# EAGLE design TConnector (EAGLE 6.5.0)
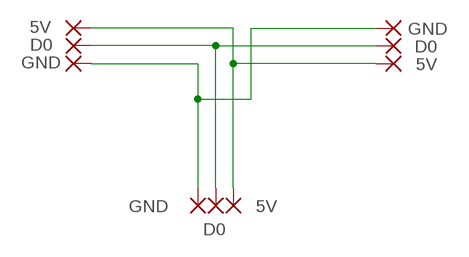
[diagram p0: schematic, sheet 1]

## Parts
5V@1  5V  SMD2  [SMD1,27-2,54]
5V@2  5V  SMD2  [SMD1,27-2,54]
5V@3  5V  SMD2  [SMD1,27-2,54]
D0  D0  SMD2  [SMD1,27-2,54]
GND@1  GND  SMD2  [SMD1,27-2,54]
GND@2  GND  SMD2  [SMD1,27-2,54]
GND@3  GND  SMD2  [SMD1,27-2,54]
PAD5  D0  SMD2  [SMD1,27-2,54]
PAD8  D0  SMD2  [SMD1,27-2,54]

## Nets
5V: 5V@1.1(P) 5V@2.1(P) 5V@3.1(P)
D0: D0.1(P) PAD5.1(P) PAD8.1(P)
GND: GND@1.1(P) GND@2.1(P) GND@3.1(P)

## Library data of the parts
5V@1-5V@3 D0 GND@1-GND@3 PAD5 PAD8 = wirepad:SMD2: SMD PAD

## Board
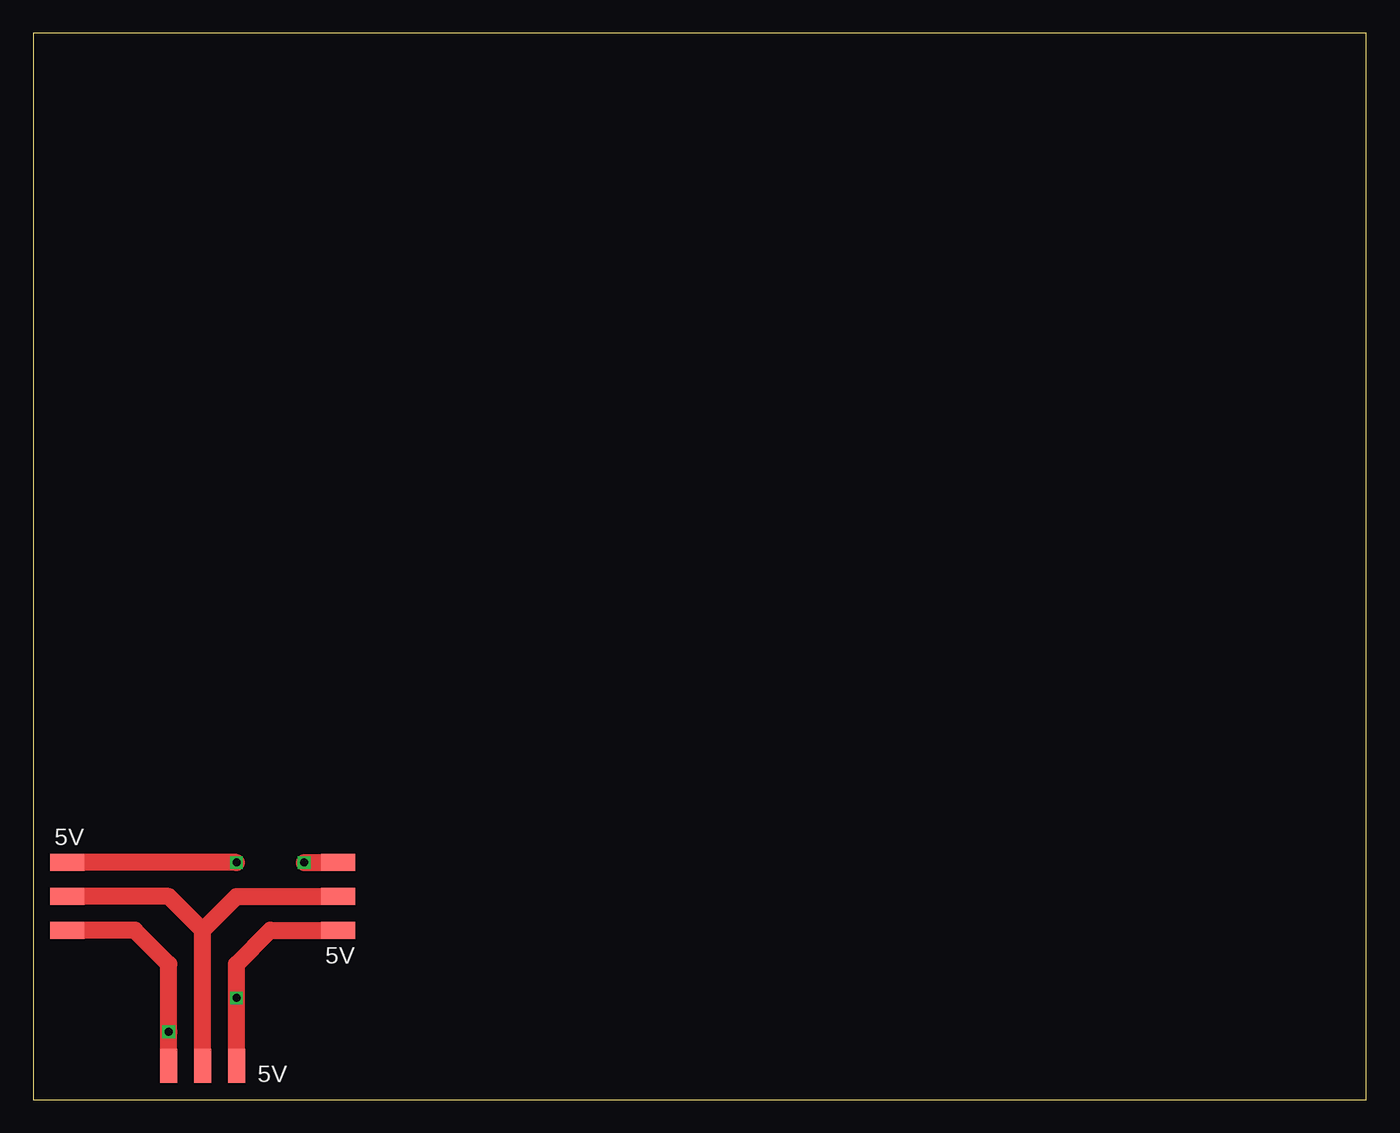
[diagram p1: board, top side]
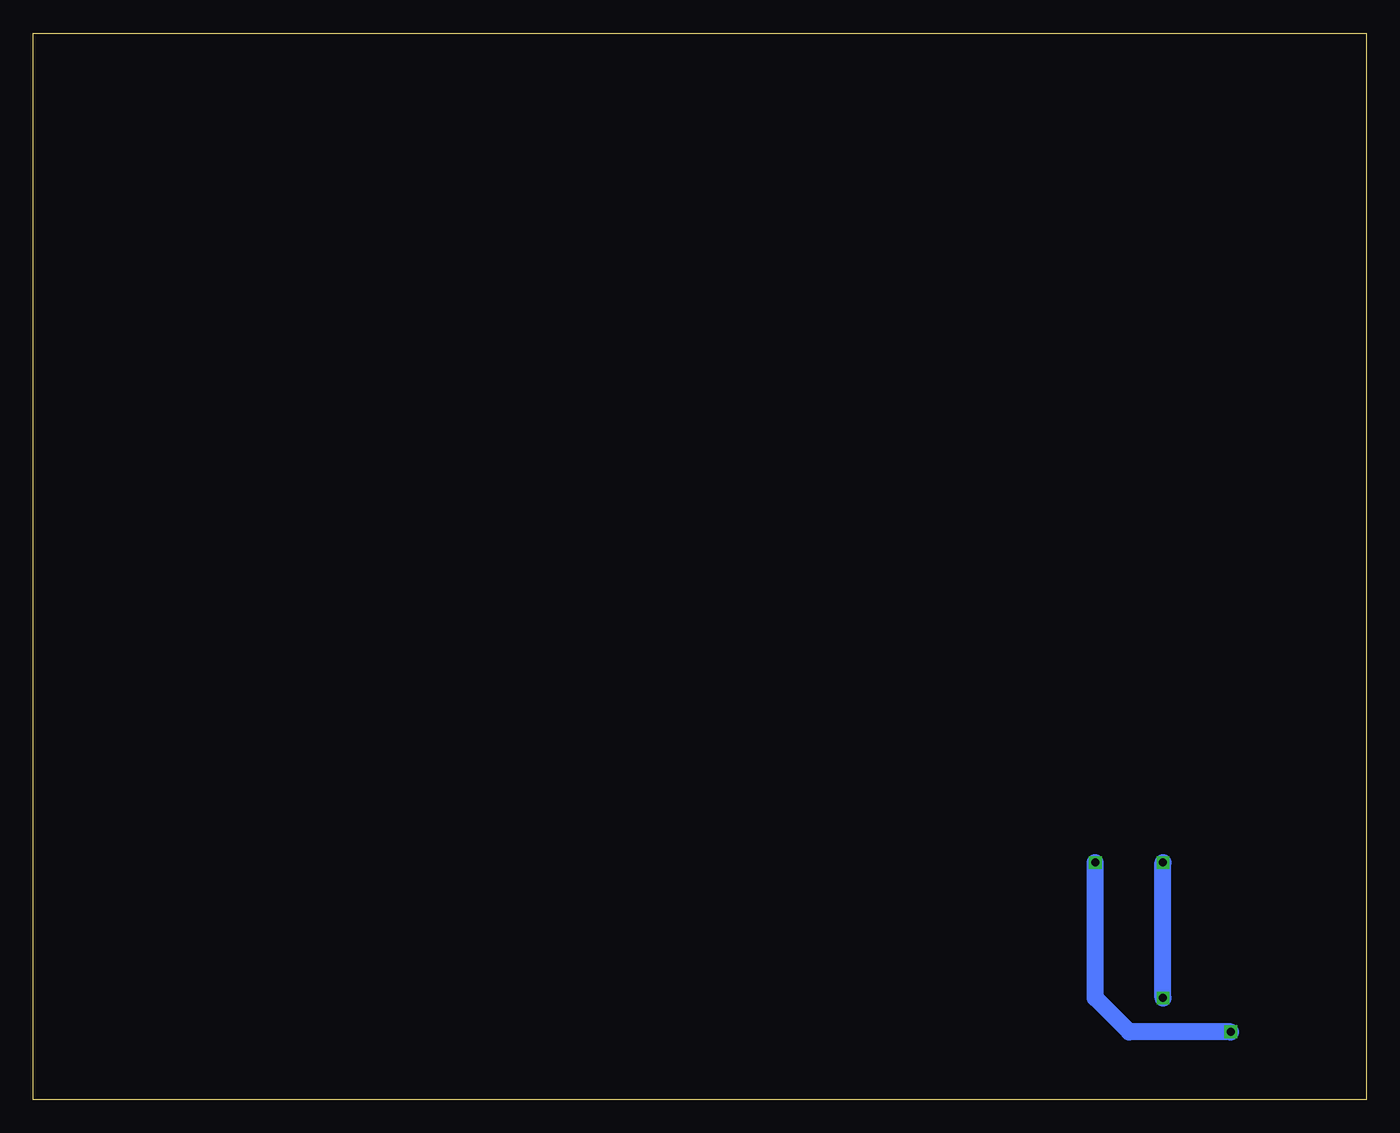
[diagram p2: board, bottom side, seen from below]

Size 100 x 80 mm. Coordinates in mm from the lower left corner, seen from the top.
Outline: 0,0 100,0 100,80 0,80 0,0
Copper layers (1*16): Top 0.0356mm / dielectric 1.5011mm / Bottom 0.0356mm
Design rules "LaenPCBOrder": minimum track width 6mil, minimum drill 13mil, track to track 6mil, track to pad 6mil, pad to pad 6mil, via to via 6mil, smd to smd 6mil, copper to edge 15mil, drill to drill 6mil, minimum pad ring 7mil, minimum via ring 7mil, stop-mask expansion 3mil, vias tented up to drill 0mil, thermal gap 10mil

### Footprints (pad centres in the part's own frame; a part is rotated, then mirrored left to right if it is on the bottom)
SMD1,27-2,54 = smd 1.27 x 2.54: 1 0,0

### Placement (x,y rotation side)
5V@1  15.24,2.54 0 top
5V@2  22.86,12.7 90 top
5V@3  2.54,17.78 90 top
D0  12.7,2.54 0 top
GND@1  10.16,2.54 0 top
GND@2  2.54,12.7 90 top
GND@3  22.86,17.78 90 top
PAD5  22.86,15.24 90 top
PAD8  2.54,15.24 90 top

### Tracks (layer width: path | path; a pad name or v marks a point on that pad's centre or on a via)
5V  (via drill 0.6)
  Top 1.27: 5V@2.1 17.78,12.7 15.24,10.16 v15.24,7.62 5V@1.1 | v15.24,17.78 5V@3.1
  Bottom 1.27: v15.24,7.62 v15.24,17.78
D0
  Top 1.27: 12.7,12.7 15.24,15.24 PAD5.1 | D0.1 12.7,12.7 | 12.7,12.7 10.16,15.24 PAD8.1
GND  (via drill 0.6)
  Top 1.27: GND@2.1 7.62,12.7 10.16,10.16 v10.16,5.08 GND@1.1 | v20.32,17.78 GND@3.1
  Bottom 1.27: v10.16,5.08 17.78,5.08 20.32,7.62 v20.32,17.78

### Text on the board
tNames: 5V | 5V | 5V